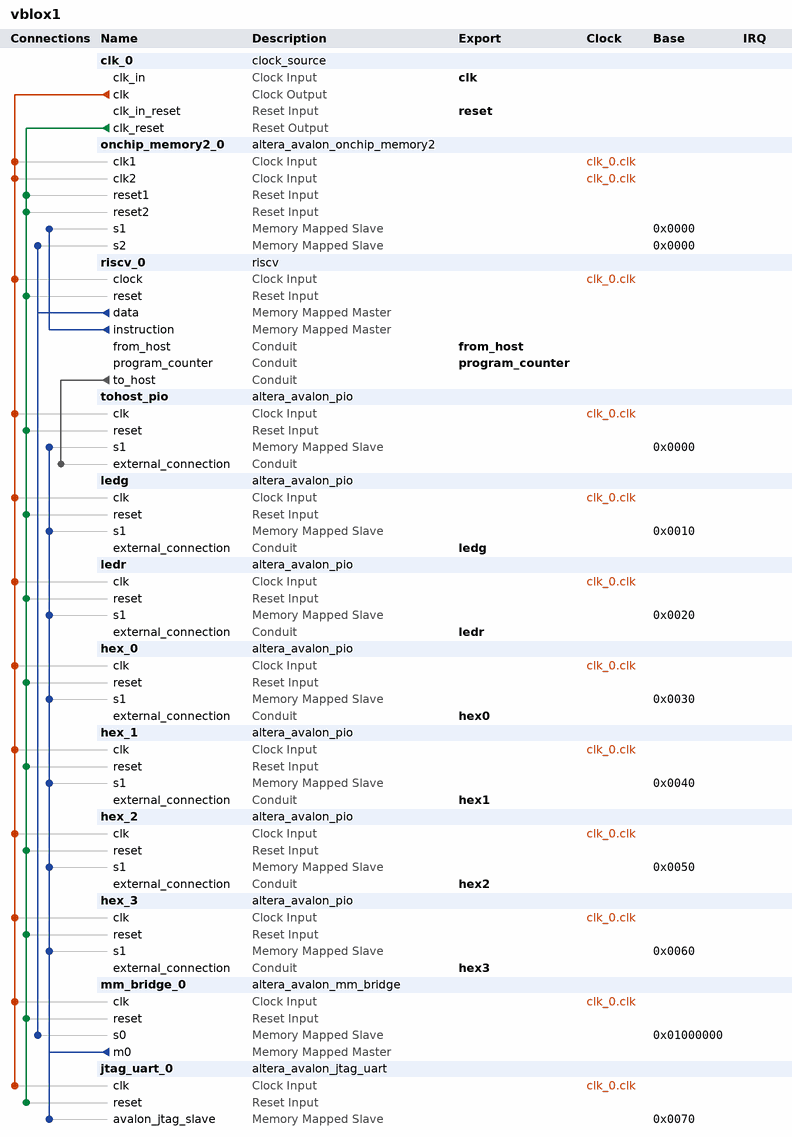
[diagram p0: system contents]
# Platform Designer (Qsys) system vblox1, Cyclone IV E EP4CE115F29C7
# Parameters at their usual value, and those the tool derives, are not listed.
package require -exact qsys 15.0
create_system vblox1
set_project_property DEVICE_FAMILY {Cyclone IV E}
set_project_property DEVICE EP4CE115F29C7

add_instance clk_0 clock_source 15.0
set_instance_parameter_value clk_0 clockFrequency 50000000

add_instance onchip_memory2_0 altera_avalon_onchip_memory2 15.0
set_instance_parameter_value onchip_memory2_0 dataWidth 32
set_instance_parameter_value onchip_memory2_0 dualPort true
set_instance_parameter_value onchip_memory2_0 initMemContent true
set_instance_parameter_value onchip_memory2_0 initializationFileName test.hex
set_instance_parameter_value onchip_memory2_0 memorySize 65536
set_instance_parameter_value onchip_memory2_0 useNonDefaultInitFile true

add_instance riscv_0 riscv 1.0
set_instance_parameter_value riscv_0 BRANCH_PREDICTION false
set_instance_parameter_value riscv_0 BTB_SIZE 256
set_instance_parameter_value riscv_0 COUNTER_LENGTH 0
set_instance_parameter_value riscv_0 DIVIDE_ENABLE 0
set_instance_parameter_value riscv_0 FORWARD_ALU_ONLY 1
set_instance_parameter_value riscv_0 MULTIPLY_ENABLE 0
set_instance_parameter_value riscv_0 PIPELINE_STAGES 5
set_instance_parameter_value riscv_0 REGISTER_SIZE 32
set_instance_parameter_value riscv_0 RESET_VECTOR 512
set_instance_parameter_value riscv_0 SHIFTER_MAX_CYCLES 8

add_instance tohost_pio altera_avalon_pio 15.0
set_instance_parameter_value tohost_pio direction Input
set_instance_parameter_value tohost_pio width 32

add_instance ledg altera_avalon_pio 15.0
set_instance_parameter_value ledg direction Output
set_instance_parameter_value ledg width 32

add_instance ledr altera_avalon_pio 15.0
set_instance_parameter_value ledr direction Output
set_instance_parameter_value ledr width 32

add_instance hex_0 altera_avalon_pio 15.0
set_instance_parameter_value hex_0 direction Output
set_instance_parameter_value hex_0 width 32

add_instance hex_1 altera_avalon_pio 15.0
set_instance_parameter_value hex_1 direction Output
set_instance_parameter_value hex_1 width 32

add_instance hex_2 altera_avalon_pio 15.0
set_instance_parameter_value hex_2 direction Output
set_instance_parameter_value hex_2 width 32

add_instance hex_3 altera_avalon_pio 15.0
set_instance_parameter_value hex_3 direction Output
set_instance_parameter_value hex_3 width 32

add_instance mm_bridge_0 altera_avalon_mm_bridge 15.0
set_instance_parameter_value mm_bridge_0 ADDRESS_UNITS SYMBOLS
set_instance_parameter_value mm_bridge_0 ADDRESS_WIDTH 10
set_instance_parameter_value mm_bridge_0 DATA_WIDTH 32
set_instance_parameter_value mm_bridge_0 MAX_PENDING_RESPONSES 1
set_instance_parameter_value mm_bridge_0 USE_AUTO_ADDRESS_WIDTH 1

add_instance jtag_uart_0 altera_avalon_jtag_uart 15.0
set_instance_parameter_value jtag_uart_0 simInteractiveOptions NO_INTERACTIVE_WINDOWS

# connections
add_connection clk_0.clk hex_0.clk clock
add_connection clk_0.clk hex_1.clk clock
add_connection clk_0.clk hex_2.clk clock
add_connection clk_0.clk hex_3.clk clock
add_connection clk_0.clk jtag_uart_0.clk clock
add_connection clk_0.clk ledg.clk clock
add_connection clk_0.clk ledr.clk clock
add_connection clk_0.clk mm_bridge_0.clk clock
add_connection clk_0.clk onchip_memory2_0.clk1 clock
add_connection clk_0.clk onchip_memory2_0.clk2 clock
add_connection clk_0.clk riscv_0.clock clock
add_connection clk_0.clk tohost_pio.clk clock
add_connection clk_0.clk_reset hex_0.reset reset
add_connection clk_0.clk_reset hex_1.reset reset
add_connection clk_0.clk_reset hex_2.reset reset
add_connection clk_0.clk_reset hex_3.reset reset
add_connection clk_0.clk_reset jtag_uart_0.reset reset
add_connection clk_0.clk_reset ledg.reset reset
add_connection clk_0.clk_reset ledr.reset reset
add_connection clk_0.clk_reset mm_bridge_0.reset reset
add_connection clk_0.clk_reset onchip_memory2_0.reset1 reset
add_connection clk_0.clk_reset onchip_memory2_0.reset2 reset
add_connection clk_0.clk_reset riscv_0.reset reset
add_connection clk_0.clk_reset tohost_pio.reset reset
add_connection mm_bridge_0.m0 hex_0.s1 avalon
set_connection_parameter_value mm_bridge_0.m0/hex_0.s1 baseAddress 0x0030
add_connection mm_bridge_0.m0 hex_1.s1 avalon
set_connection_parameter_value mm_bridge_0.m0/hex_1.s1 baseAddress 0x0040
add_connection mm_bridge_0.m0 hex_2.s1 avalon
set_connection_parameter_value mm_bridge_0.m0/hex_2.s1 baseAddress 0x0050
add_connection mm_bridge_0.m0 hex_3.s1 avalon
set_connection_parameter_value mm_bridge_0.m0/hex_3.s1 baseAddress 0x0060
add_connection mm_bridge_0.m0 jtag_uart_0.avalon_jtag_slave avalon
set_connection_parameter_value mm_bridge_0.m0/jtag_uart_0.avalon_jtag_slave baseAddress 0x0070
add_connection mm_bridge_0.m0 ledg.s1 avalon
set_connection_parameter_value mm_bridge_0.m0/ledg.s1 baseAddress 0x0010
add_connection mm_bridge_0.m0 ledr.s1 avalon
set_connection_parameter_value mm_bridge_0.m0/ledr.s1 baseAddress 0x0020
add_connection mm_bridge_0.m0 tohost_pio.s1 avalon
set_connection_parameter_value mm_bridge_0.m0/tohost_pio.s1 baseAddress 0x0000
add_connection riscv_0.data mm_bridge_0.s0 avalon
set_connection_parameter_value riscv_0.data/mm_bridge_0.s0 baseAddress 0x01000000
add_connection riscv_0.data onchip_memory2_0.s2 avalon
set_connection_parameter_value riscv_0.data/onchip_memory2_0.s2 baseAddress 0x0000
add_connection riscv_0.instruction onchip_memory2_0.s1 avalon
set_connection_parameter_value riscv_0.instruction/onchip_memory2_0.s1 baseAddress 0x0000
add_connection riscv_0.to_host tohost_pio.external_connection conduit

# exported interfaces
add_interface clk clock sink
set_interface_property clk EXPORT_OF clk_0.clk_in
add_interface from_host conduit end
set_interface_property from_host EXPORT_OF riscv_0.from_host
add_interface hex0 conduit end
set_interface_property hex0 EXPORT_OF hex_0.external_connection
add_interface hex1 conduit end
set_interface_property hex1 EXPORT_OF hex_1.external_connection
add_interface hex2 conduit end
set_interface_property hex2 EXPORT_OF hex_2.external_connection
add_interface hex3 conduit end
set_interface_property hex3 EXPORT_OF hex_3.external_connection
add_interface ledg conduit end
set_interface_property ledg EXPORT_OF ledg.external_connection
add_interface ledr conduit end
set_interface_property ledr EXPORT_OF ledr.external_connection
add_interface program_counter conduit end
set_interface_property program_counter EXPORT_OF riscv_0.program_counter
add_interface reset reset sink
set_interface_property reset EXPORT_OF clk_0.clk_in_reset

set_interconnect_requirement {$system} qsys_mm.clockCrossingAdapter HANDSHAKE
set_interconnect_requirement {$system} qsys_mm.insertDefaultSlave FALSE
set_interconnect_requirement {$system} qsys_mm.maxAdditionalLatency 1

save_system vblox1.qsys
